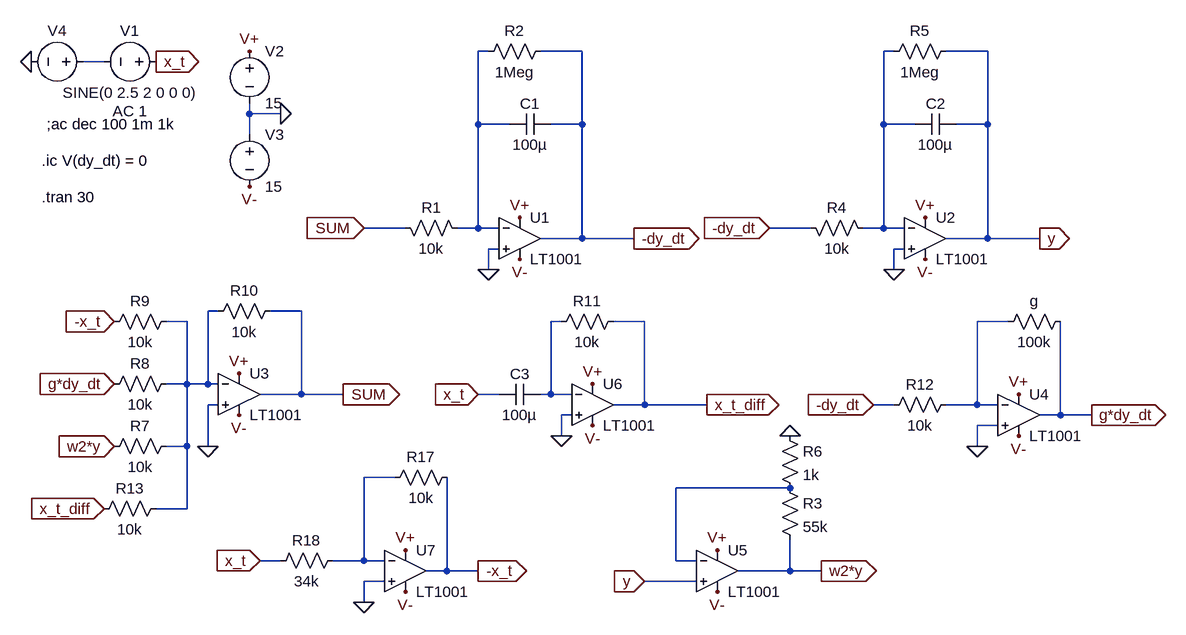
[diagram p0: schematic Analogue_Computer_FINAL_EXT_NONINV.asc]
Analogue_Computer_FINAL_EXT_NONINV.asc, the LTspice schematic file:
Version 4
SHEET 1 1932 1080
WIRE 32 -352 16 -352
WIRE 176 -352 112 -352
WIRE 656 -352 640 -352
WIRE 800 -352 736 -352
WIRE -560 -336 -592 -336
WIRE -336 -256 -336 -272
WIRE -288 -256 -336 -256
WIRE 16 -240 16 -352
WIRE 64 -240 16 -240
WIRE 176 -240 176 -352
WIRE 176 -240 128 -240
WIRE 640 -240 640 -352
WIRE 688 -240 640 -240
WIRE 800 -240 800 -352
WIRE 800 -240 752 -240
WIRE -336 -224 -336 -256
WIRE -96 -80 -160 -80
WIRE 16 -80 16 -240
WIRE 16 -80 -16 -80
WIRE 48 -80 16 -80
WIRE 528 -80 464 -80
WIRE 640 -80 640 -240
WIRE 640 -80 608 -80
WIRE 672 -80 640 -80
WIRE 176 -64 176 -240
WIRE 176 -64 112 -64
WIRE 256 -64 176 -64
WIRE 800 -64 800 -240
WIRE 800 -64 736 -64
WIRE 880 -64 800 -64
WIRE 48 -48 32 -48
WIRE 672 -48 656 -48
WIRE 32 -16 32 -48
WIRE 656 -16 656 -48
WIRE -384 48 -400 48
WIRE -256 48 -304 48
WIRE -432 64 -464 64
WIRE 144 64 128 64
WIRE 272 64 224 64
WIRE 832 64 784 64
WIRE -432 160 -432 64
WIRE -432 160 -464 160
WIRE -400 160 -400 48
WIRE -400 160 -432 160
WIRE -384 160 -400 160
WIRE -256 176 -256 48
WIRE -256 176 -320 176
WIRE -192 176 -256 176
WIRE 48 176 16 176
WIRE 128 176 128 64
WIRE 128 176 112 176
WIRE 160 176 128 176
WIRE -384 192 -400 192
WIRE 272 192 272 64
WIRE 272 192 224 192
WIRE 368 192 272 192
WIRE 656 192 624 192
WIRE 784 192 784 64
WIRE 784 192 736 192
WIRE 816 192 784 192
WIRE 160 208 144 208
WIRE 912 208 912 64
WIRE 912 208 880 208
WIRE 960 208 912 208
WIRE 816 224 784 224
WIRE 144 240 144 208
WIRE -432 256 -432 160
WIRE -432 256 -464 256
WIRE -400 256 -400 192
WIRE 784 256 784 224
WIRE -112 304 -160 304
WIRE 496 320 320 320
WIRE -432 352 -432 256
WIRE -432 352 -480 352
WIRE -288 432 -320 432
WIRE -160 432 -160 304
WIRE -160 432 -208 432
WIRE -128 432 -160 432
WIRE 320 432 320 320
WIRE 352 432 320 432
WIRE -32 448 -32 304
WIRE -32 448 -64 448
WIRE 16 448 -32 448
WIRE 496 448 496 400
WIRE 496 448 416 448
WIRE 544 448 496 448
WIRE -128 464 -160 464
WIRE 352 464 272 464
WIRE -160 496 -160 464
FLAG -288 -256 0
FLAG -336 -352 V+
FLAG -336 -144 V-
FLAG 80 -96 V+
FLAG 80 -32 V-
FLAG 256 -64 -dy_dt
IOPIN 256 -64 Out
FLAG -480 -336 x_t
IOPIN -480 -336 Out
FLAG 704 -96 V+
FLAG 704 -32 V-
FLAG 880 -64 y
IOPIN 880 -64 Out
FLAG 464 -80 -dy_dt
IOPIN 464 -80 In
FLAG -352 144 V+
FLAG -352 208 V-
FLAG -192 176 SUM
IOPIN -192 176 Out
FLAG -400 256 0
FLAG -160 -80 SUM
IOPIN -160 -80 In
FLAG 784 256 0
FLAG 624 192 -dy_dt
IOPIN 624 192 In
FLAG 960 208 g*dy_dt
IOPIN 960 208 Out
FLAG -160 496 0
FLAG -544 64 -x_t
IOPIN -544 64 In
FLAG -544 256 w2*y
IOPIN -544 256 In
FLAG -544 160 g*dy_dt
IOPIN -544 160 In
FLAG -96 416 V+
FLAG 848 176 V+
FLAG -96 480 V-
FLAG 848 240 V-
FLAG -672 -336 0
FLAG 32 -16 0
FLAG 656 -16 0
FLAG 384 416 V+
FLAG 384 480 V-
FLAG 272 464 y
IOPIN 272 464 In
FLAG 496 240 0
FLAG 544 448 w2*y
IOPIN 544 448 Out
FLAG 192 160 V+
FLAG 192 224 V-
FLAG 144 240 0
FLAG 16 176 x_t
IOPIN 16 176 In
FLAG 368 192 x_t_diff
IOPIN 368 192 Out
FLAG -560 352 x_t_diff
IOPIN -560 352 In
FLAG -320 432 x_t
IOPIN -320 432 In
FLAG 16 448 -x_t
IOPIN 16 448 Out
SYMBOL OpAmps\\LT1001 80 -128 R0
SYMATTR InstName U1
SYMBOL res -112 -96 M90
WINDOW 0 0 56 VBottom 2
WINDOW 3 32 56 VTop 2
SYMATTR InstName R1
SYMATTR Value 10k
SYMBOL voltage -464 -336 R90
WINDOW 0 -32 56 VBottom 2
WINDOW 3 32 56 VTop 2
WINDOW 123 60 56 VTop 2
WINDOW 39 0 0 Left 0
SYMATTR InstName V1
SYMATTR Value SINE(0 2.5 2 0 0 0)
SYMATTR Value2 AC 1
SYMBOL voltage -336 -368 R0
WINDOW 123 0 0 Left 0
WINDOW 39 0 0 Left 0
SYMATTR InstName V2
SYMATTR Value 15
SYMBOL voltage -336 -240 R0
WINDOW 123 0 0 Left 0
WINDOW 39 0 0 Left 0
SYMATTR InstName V3
SYMATTR Value 15
SYMBOL cap 128 -256 R90
WINDOW 0 0 32 VBottom 2
WINDOW 3 32 32 VTop 2
SYMATTR InstName C1
SYMATTR Value 100µ
SYMBOL res 128 -368 R90
WINDOW 0 0 56 VBottom 2
WINDOW 3 32 56 VTop 2
SYMATTR InstName R2
SYMATTR Value 1Meg
SYMBOL OpAmps\\LT1001 704 -128 R0
SYMATTR InstName U2
SYMBOL res 512 -96 M90
WINDOW 0 0 56 VBottom 2
WINDOW 3 32 56 VTop 2
SYMATTR InstName R4
SYMATTR Value 10k
SYMBOL cap 752 -256 R90
WINDOW 0 0 32 VBottom 2
WINDOW 3 32 32 VTop 2
SYMATTR InstName C2
SYMATTR Value 100µ
SYMBOL res 752 -368 R90
WINDOW 0 0 56 VBottom 2
WINDOW 3 32 56 VTop 2
SYMATTR InstName R5
SYMATTR Value 1Meg
SYMBOL OpAmps\\LT1001 -352 112 R0
SYMATTR InstName U3
SYMBOL res -448 240 R90
WINDOW 0 0 56 VBottom 2
WINDOW 3 32 56 VTop 2
SYMATTR InstName R7
SYMATTR Value 10k
SYMBOL res -448 144 R90
WINDOW 0 0 56 VBottom 2
WINDOW 3 32 56 VTop 2
SYMATTR InstName R8
SYMATTR Value 10k
SYMBOL res -448 48 R90
WINDOW 0 0 56 VBottom 2
WINDOW 3 32 56 VTop 2
SYMATTR InstName R9
SYMATTR Value 10k
SYMBOL res -288 32 R90
WINDOW 0 0 56 VBottom 2
WINDOW 3 32 56 VTop 2
SYMATTR InstName R10
SYMATTR Value 10k
SYMBOL OpAmps\\LT1001 848 144 R0
SYMATTR InstName U4
SYMBOL res 928 48 R90
WINDOW 0 0 56 VBottom 2
WINDOW 3 32 56 VTop 2
SYMATTR InstName g
SYMATTR Value 100k
SYMBOL res 752 176 R90
WINDOW 0 0 56 VBottom 2
WINDOW 3 32 56 VTop 2
SYMATTR InstName R12
SYMATTR Value 10k
SYMBOL OpAmps\\LT1001 -96 384 R0
SYMATTR InstName U7
SYMBOL res -16 288 R90
WINDOW 0 0 56 VBottom 2
WINDOW 3 32 56 VTop 2
SYMATTR InstName R17
SYMATTR Value 10k
SYMBOL res -192 416 R90
WINDOW 0 0 56 VBottom 2
WINDOW 3 32 56 VTop 2
SYMATTR InstName R18
SYMATTR Value 34k
SYMBOL voltage -576 -336 R90
WINDOW 0 -32 56 VBottom 2
WINDOW 3 32 56 VTop 2
WINDOW 123 0 0 Left 0
WINDOW 39 0 0 Left 0
SYMATTR InstName V4
SYMATTR Value ""
SYMBOL OpAmps\\LT1001 384 384 R0
SYMATTR InstName U5
SYMBOL res 480 304 R0
SYMATTR InstName R3
SYMATTR Value 55k
SYMBOL res 480 224 R0
SYMATTR InstName R6
SYMATTR Value 1k
SYMBOL OpAmps\\LT1001 192 128 R0
SYMATTR InstName U6
SYMBOL cap 112 160 R90
WINDOW 0 0 32 VBottom 2
WINDOW 3 32 32 VTop 2
SYMATTR InstName C3
SYMATTR Value 100µ
SYMBOL res 240 48 R90
WINDOW 0 0 56 VBottom 2
WINDOW 3 32 56 VTop 2
SYMATTR InstName R11
SYMATTR Value 10k
SYMBOL res -464 336 R90
WINDOW 0 0 56 VBottom 2
WINDOW 3 32 56 VTop 2
SYMATTR InstName R13
SYMATTR Value 10k
TEXT -648 -240 Left 2 !;ac dec 100 1m 1k
TEXT -656 -184 Left 2 !.ic V(dy_dt) = 0
TEXT -656 -128 Left 2 !.tran 30

The netlist it stands for:
* Analogue_Computer_FINAL_EXT_NONINV.asc
XU1 0 N001 V+ V- -dy_dt LT1001  ; pins In+ In- V+ V- OUT
R1 SUM N001 10k
V1 x_t N003 SINE(0 2.5 2 0 0 0) AC 1
V2 V+ 0 15
V3 0 V- 15
C1 -dy_dt N001 100µ
R2 -dy_dt N001 1Meg
XU2 0 N002 V+ V- y LT1001  ; pins In+ In- V+ V- OUT
R4 -dy_dt N002 10k
C2 y N002 100µ
R5 y N002 1Meg
XU3 0 N004 V+ V- SUM LT1001  ; pins In+ In- V+ V- OUT
R7 N004 w2*y 10k
R8 N004 g*dy_dt 10k
R9 N004 -x_t 10k
R10 SUM N004 10k
XU4 0 N006 V+ V- g*dy_dt LT1001  ; pins In+ In- V+ V- OUT
R§g g*dy_dt N006 100k
R12 N006 -dy_dt 10k
XU7 0 N007 V+ V- -x_t LT1001  ; pins In+ In- V+ V- OUT
R17 -x_t N007 10k
R18 N007 x_t 34k
V4 N003 0
XU5 y N008 V+ V- w2*y LT1001  ; pins In+ In- V+ V- OUT
R3 N008 w2*y 55k
R6 0 N008 1k
XU6 0 N005 V+ V- x_t_diff LT1001  ; pins In+ In- V+ V- OUT
C3 N005 x_t 100µ
R11 x_t_diff N005 10k
R13 N004 x_t_diff 10k
;ac dec 100 1m 1k
.ic V(dy_dt) = 0
.tran 30
.lib LTC.lib
.backanno
.end